# EAGLE design FL-Ver0.7 (EAGLE 6.3)
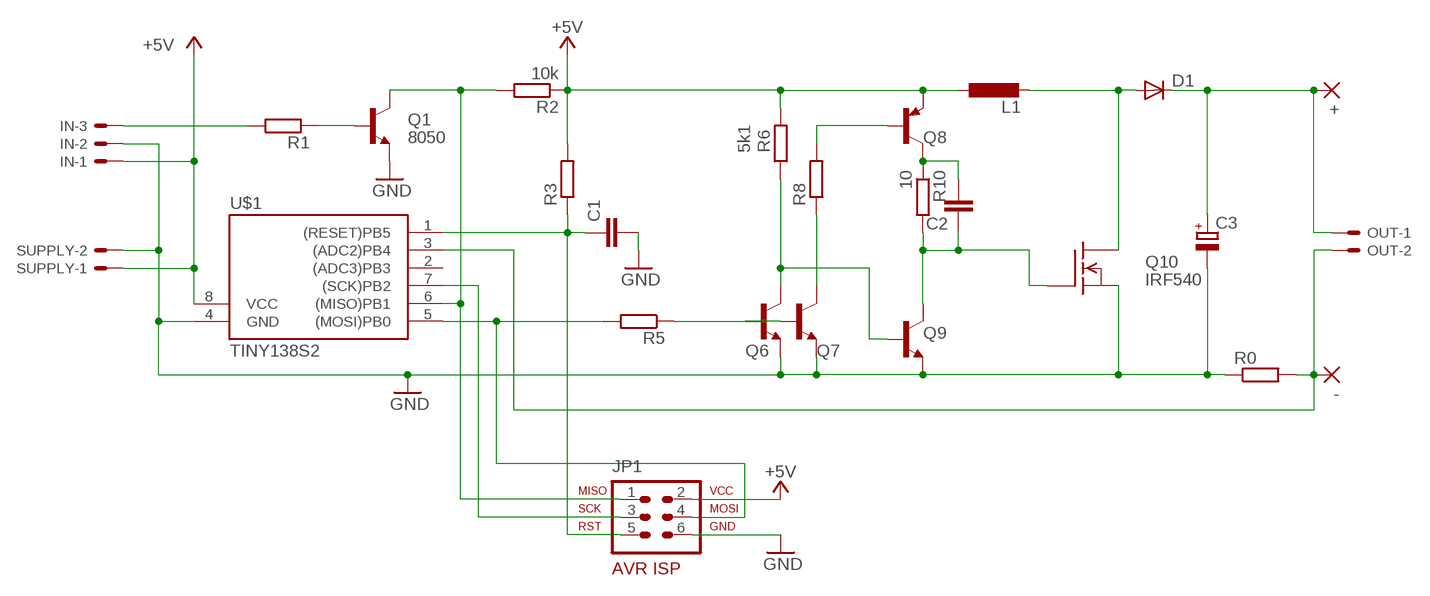
[diagram p0: schematic, sheet 1]

## Parts
+  1,6/0,9  [1,6/0,9]
-  1,6/0,9  [1,6/0,9]
C1  C-EUC0805  [C0805]
C2  C-EUC0805  [C0805]
C3  CPOL-EU153CLV-0807  [153CLV-0807]
D1  DIODE-SMB  [SMB]
IN  22-23-2031  [22-23-2031]
JP1  AVR-ISP-6VERT  [AVR-ISP-6]
L1  DO3316P  [DO3316P]
OUT  22-23-2021  [22-23-2021]
Q1  8050  SS8050SMDSMD  [SOT23-BEC]
Q6  SS8050SMDSMD  [SOT23-BEC]
Q7  SS8050SMDSMD  [SOT23-BEC]
Q8  SS8550SMDSMD  [SOT23-BEC]
Q9  SS8050SMDSMD  [SOT23-BEC]
Q10  IRF540  [TO220]
R0  R-EU_0613/15  [P0613/15]
R1  R-EU_M0805  [M0805]
R2  10k  R-EU_M0805  [M0805]
R3  R-EU_M0805  [M0805]
R5  R-EU_M0805  [M0805]
R6  5k1  R-EU_M0805  [M0805]
R8  R-EU_M0805  [M0805]
R10  10  R-EU_M0805  [M0805]
SUPPLY  22-23-2021  [22-23-2021]
U$1  TINY138S2  [SO08]

## Nets
+5V: IN.1 JP1.2 L1.2 Q8.E R2.1 R3.2 R6.2 SUPPLY.1 U$1.8(VCC)
FET-D: D1.A L1.1 Q10.2(D)
GND: C1.2 C3.- IN.2 JP1.6 Q1.E Q6.E Q7.E Q9.E Q10.3(S) R0.1 SUPPLY.2 U$1.4(GND)
N$1: Q6.C Q9.B R6.1
N$2: JP1.3 U$1.7((SCK)PB2)
N$3: Q6.B Q7.B R5.1
N$4: C1.1 JP1.5 R3.1 U$1.1((RESET)PB5)
N$6: Q8.B R8.2
N$7: C2.2 Q8.C R10.1
N$8: C2.1 Q9.C Q10.1(G) R10.2
N$9: Q1.B R1.1
N$10: IN.3 R1.2
N$11: +.1(P) C3.+ D1.C OUT.1
N$12: JP1.4 R5.2 U$1.5((MOSI)PB0)
N$13: JP1.1 Q1.C R2.2 U$1.6((MISO)PB1)
N$16: -.1(P) OUT.2 R0.2 U$1.3((ADC2)PB4)
N$17: Q7.C R8.1
Unconnected: U$1.2((ADC3)PB3)

## Library data of the parts
+ - = _wirepad:1,6/0,9: THROUGH-HOLE PAD
C1 C2 = _myrc:C-EU: CAPACITOR, European symbol
C3 = _resistor:CPOL-EU: POLARIZED CAPACITOR, European symbol
D1 = _diode_mod:DIODE-: DIODE
IN = _con-molex:22-23-2031: .100" (2.54mm) Center Header - 3 Pin
JP1 = _Atmel-avr-7:AVR-ISP-6: AVR ISP-6 Serial Programming Header
L1 = inductor-coilcraft:DO3316P: COILCRAFT; OC_FARNELL: unknown; OC_NEWARK: unknown
OUT SUPPLY = _con-molex:22-23-2021: .100" (2.54mm) Center Header - 2 Pin
Q1 Q6 Q7 Q9 = _mylbr:SS8050SMD: NPN Transistor
Q8 = _mylbr:SS8550SMD: PNP Transistror
Q10 = transistor-fet:IRF540: N-Channel Enhancement MOSFET (HEXFET); 100V; 28A; 0,077Ohm
R0 = _resistor:R-EU_: RESISTOR, European symbol
R1-R3 R5 R6 R8 R10 = _myrc:R-EU_: RESISTOR, European symbol
U$1 = _Atmel-avr-7:TINY13*

## Board
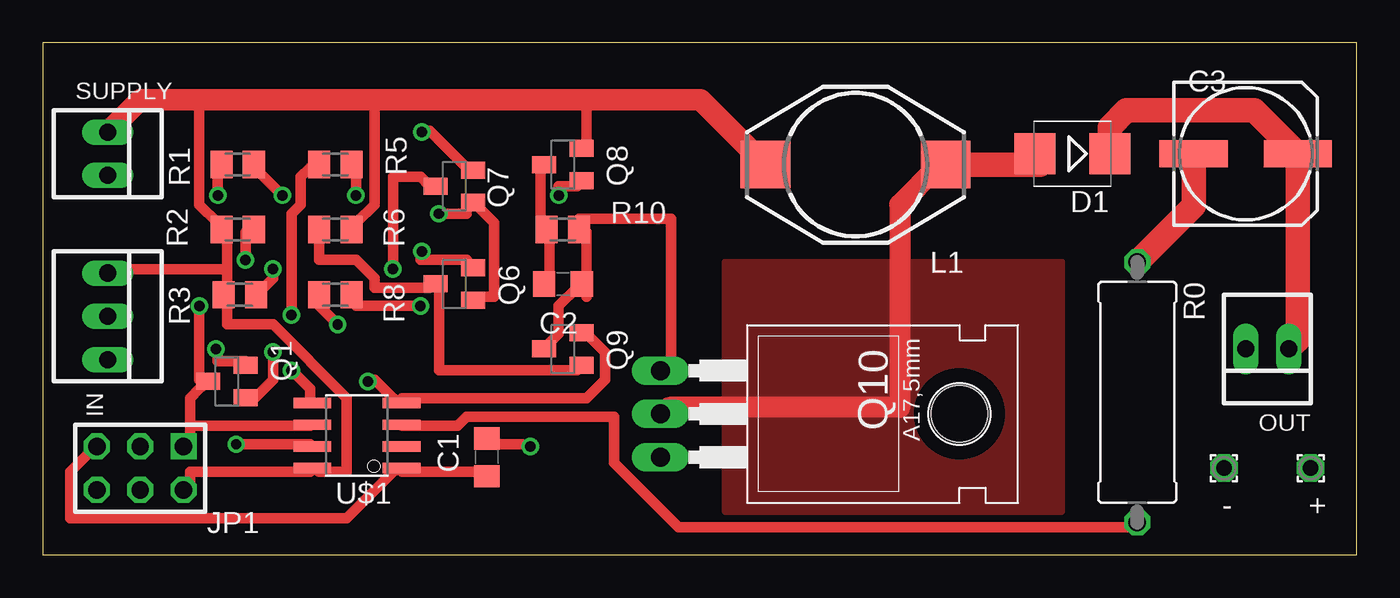
[diagram p1: board, top side]
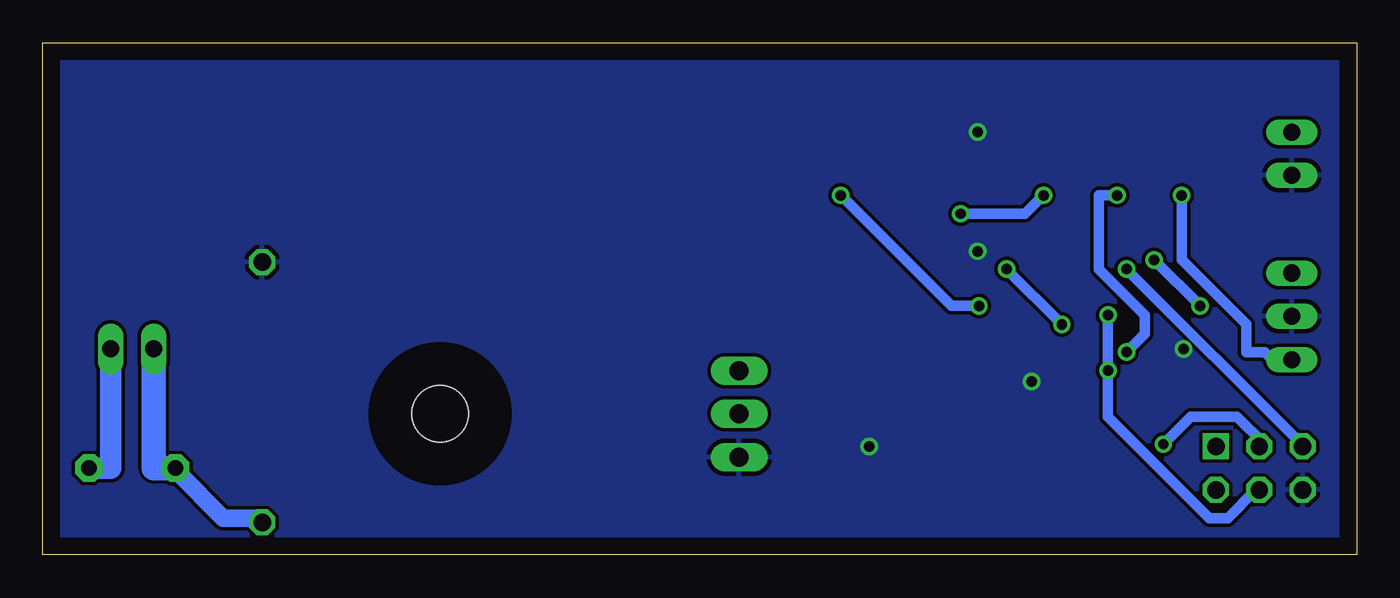
[diagram p2: board, bottom side, seen from below]

Size 77 x 30 mm. Coordinates in mm from the lower left corner, seen from the top.
Outline: 0,0 77,0 77,30 0,30 0,0
Copper layers (1*16): Top 0.035mm / dielectric 1.5mm / Bottom 0.035mm
Design rules "default *": minimum track width 24mil, minimum drill 24mil, track to track 8mil, track to pad 8mil, pad to pad 8mil, via to via 8mil, smd to smd 8mil, copper to edge 40mil, drill to drill 8mil, minimum pad ring 10mil, minimum via ring 8mil, stop-mask expansion 4mil, vias tented up to drill 0mil, thermal gap 10mil

### Footprints (pad centres in the part's own frame; a part is rotated, then mirrored left to right if it is on the bottom)
1,6/0,9 = drill 0.914 pad 1.6 octagon: 1 0,0
C0805 = smd 1.3 x 1.5: 1 -1.104,0; 2 1.104,0
153CLV-0807 = smd 4 x 1.6: + 3.05,0; - -3.05,0
SMB = smd 2.4 x 2.4: A 2.2,0; C -2.2,0
22-23-2031 = drill 1 long: 1 -2.54,0; 2 0,0; 3 2.54,0
AVR-ISP-6 = drill 1.016 square: 1 -2.54,-1.27 | drill 1.016 octagon: 2 -2.54,1.27; 3 0,-1.27; 4 0,1.27; 5 2.54,-1.27; 6 2.54,1.27
DO3316P = smd 2.92 x 2.79: 1 -5.28,0; 2 5.28,0
22-23-2021 = drill 1 long: 1 -1.27,0; 2 1.27,0
SOT23-BEC = smd 1 x 1.4: B -0.95,-1.1; C 0,1.1; E 0.95,-1.1
TO220 = drill 1.118 long: 1 -2.54,-6.35; 2 0,-6.35; 3 2.54,-6.35 | hole 3.302: 0,11.176
P0613/15 = drill 1.016 octagon: 1 -7.62,0; 2 7.62,0
M0805 = smd 1.3 x 1.6: 1 -0.95,0; 2 0.95,0
SO08 = smd 0.61 x 2.21: 1 -1.905,-2.616; 2 -0.635,-2.616; 3 0.635,-2.616; 4 1.905,-2.616; 5 1.905,2.616; 6 0.635,2.616; 7 -0.635,2.616; 8 -1.905,2.616

### Placement (x,y rotation side)
+  74.3,5.08 180 top
-  69.22,5.08 0 top
C1  26.04,5.71 90 top
C2  30.48,15.88 180 top
C3  70.48,23.5 0 top
D1  60.33,23.5 180 top
IN  3.81,13.97 270 top
JP1  5.71,5.08 180 top
L1  47.62,22.86 180 top
OUT  71.75,12.06 180 top
Q1  10.79,10.16 90 top
Q6  24.13,15.88 90 top
Q7  24.13,21.59 90 top
Q8  30.48,22.86 90 top
Q9  30.48,12.06 90 top
Q10  42.55,8.26 270 top
R0  64.14,9.53 270 top
R1  11.43,22.86 180 top
R2  11.43,19.05 0 top
R3  11.56,15.24 180 top
R5  17.14,22.86 180 top
R6  17.14,19.05 0 top
R8  17.14,15.24 0 top
R10  30.48,19.05 0 top
SUPPLY  3.81,23.5 270 top
U$1  18.41,6.99 90 top

### Tracks (layer width: path | path; a pad name or v marks a point on that pad's centre or on a via)
+5V
  Top 0.61: JP1.2 8.64,4.32 8.64,4.86 15.66,4.86 U$1.8 16.2,4.86 17.82,4.86 17.82,9.18 13.5,13.5 10.8,13.5 10.8,15.12 R3.2 10.8,15.66 10.8,16.74 | 10.8,16.74 10.8,18.9 R2.1 10.26,19.44 9.18,20.52 9.18,26.67 | 10.8,16.74 4.32,16.74 IN.1 | 31.86,26.67 31.86,24.3 Q8.E | 19.44,26.67 19.44,20.52 18.36,19.44 R6.2
  Top 1.27: SUPPLY.1 5.71,26.67 9.18,26.67 19.44,26.67 31.86,26.67 38.53,26.67 L1.2
FET-D
  Top 0.61: D1.A 58.32,23.22 58.32,22.86
  Top 1.219: Q10.2 36.72,8.64 50.22,8.64 50.22,20.52 52.38,22.68 L1.1
  Top 1.422: L1.1 58.32,22.86 58.42,22.86
  pour Top: 40.01,17.14 59.69,17.14 59.69,2.54 40.01,2.54
GND  (via drill 0.61)
  Top 0.61: 25.18,16.74 25.38,16.74 Q6.E 24.84,17.28 22.14,17.28 v22.23,17.78 | Q9.E 31.86,12.96 32.94,11.88 32.94,10.26 31.86,9.18 21.06,9.18 U$1.4 20.52,9.18 19.44,10.26 v19.05,10.16 | Q1.E 11.88,11.34 10.26,11.34 10.26,11.88 v10.16,12.06 | Q7.E 24.84,22.68 22.68,24.84 v22.23,24.77 | C1.2 26.46,6.48 28.08,6.48 v28.57,6.35
  Top 1.422: C3.- 67.44,20.45 R0.1
  pour Bottom: 0,29.84 76.83,29.84 76.83,0 0,0
N$1
  Top 0.61: R6.1 16.2,18.9 16.2,17.28 18.36,17.28 19.44,16.2 19.44,15.66 22.68,15.66 Q6.C 23.22,15.66 23.22,10.8 31.32,10.8 Q9.B
N$2  (via drill 0.61)
  Top 0.61: v11.34,6.48 15.66,6.48 U$1.7
  Bottom 0.61: v11.34,6.48 9.72,8.1 7.02,8.1 5.4,6.48 JP1.3
N$3  (via drill 0.61)
  Top 0.61: Q6.B 25.38,15.12 26.46,15.12 26.46,19.44 25.38,20.52 Q7.B 24.84,20.52 24.84,19.98 v23.22,19.98 | v18.36,21.06 18.36,22.68 R5.1
  Bottom 0.61: v18.36,21.06 19.44,19.98 v23.22,19.98
N$4  (via drill 0.61)
  Top 0.61: v13.5,16.74 13.5,16.2 12.96,15.66 R3.1 | JP1.5 2.7,5.94 1.62,4.86 1.62,2.16 17.82,2.16 20.52,4.86 U$1.1 21.06,4.86 25.92,4.86 C1.1
  Bottom 0.61: v13.5,16.74 3.24,6.48 JP1.5
N$6  (via drill 0.61)
  Top 0.61: v30.24,21.06 30.24,21.6 31.32,21.6 Q8.B | v22.14,14.58 18.36,14.58 18.36,15.12 R8.2
  Bottom 0.61: v30.24,21.06 23.76,14.58 v22.14,14.58
N$7
  Top 0.61: Q8.C 29.16,22.68 29.16,19.44 R10.1 29.7,18.9 29.7,16.2 C2.2
N$8
  Top 0.61: Q9.C 29.7,12.42 30.24,12.96 30.24,14.58 31.32,15.66 C2.1 | C2.1 31.86,16.2 31.86,18.9 R10.2 31.43,19.68 36.83,19.68 36.83,10.8 36.18,10.8 Q10.1 | 31.86,15.12 31.86,15.66 C2.1
N$9  (via drill 0.61)
  Top 0.61: v13.5,11.88 13.5,10.26 12.42,9.18 Q1.B | v14.04,21.06 12.42,22.68 R1.1
  Bottom 0.61: v13.5,11.88 12.42,12.96 12.42,14.04 15.12,16.74 15.12,21.06 v14.04,21.06
N$10  (via drill 0.61)
  Top 0.61: v10.26,21.06 10.26,22.68 R1.2
  Bottom 0.61: v10.26,21.06 10.26,17.28 6.48,13.5 6.48,11.88 5.4,11.88 4.86,11.34 4.32,11.34 IN.3
N$11
  Top 1.422: D1.C 62.52,25.06 63.5,26.04 71,26.04 C3.+ 73.53,12.57 OUT.1
  Bottom 1.27: +.1 73.03,5.08 OUT.1
N$12  (via drill 0.61)
  Top 0.61: v14.58,14.04 14.58,19.98 15.12,20.52 15.12,22.14 15.66,22.68 R5.2 | v14.58,10.8 15.66,9.72 15.66,9.18 U$1.5
  Bottom 0.61: v14.58,14.04 v14.58,10.8 14.58,8.1 8.64,2.16 7.56,2.16 5.94,3.78 JP1.4
N$13  (via drill 0.61)
  Top 0.61: 8.64,7.56 8.64,6.48 JP1.1 | 8.64,7.56 8.64,9.18 9.18,9.72 Q1.C 9.18,10.26 v9.18,14.58 | v11.88,17.28 11.88,18.9 R2.2 | 8.64,7.56 15.66,7.56 U$1.6
  Bottom 0.61: v9.18,14.58 v11.88,17.28
N$16
  Top 0.61: U$1.3 21.06,7.56 24.3,7.56 24.84,8.1 33.48,8.1 33.48,5.4 37.26,1.62 63.72,1.62 R0.2
  Bottom 1.016: -.1 69.12,4.86 66.42,2.16 64.26,2.16 R0.2
  Bottom 1.422: -.1 70.48,5.08 OUT.2
N$17  (via drill 0.61)
  Top 0.61: v20.52,16.74 20.52,22.14 22.14,22.14 22.68,21.6 Q7.C | v17.28,13.5 16.2,14.58 16.2,15.12 R8.1
  Bottom 0.61: v17.28,13.5 v20.52,16.74